# EAGLE design MOSBRIDGE (EAGLE 9.4.2)
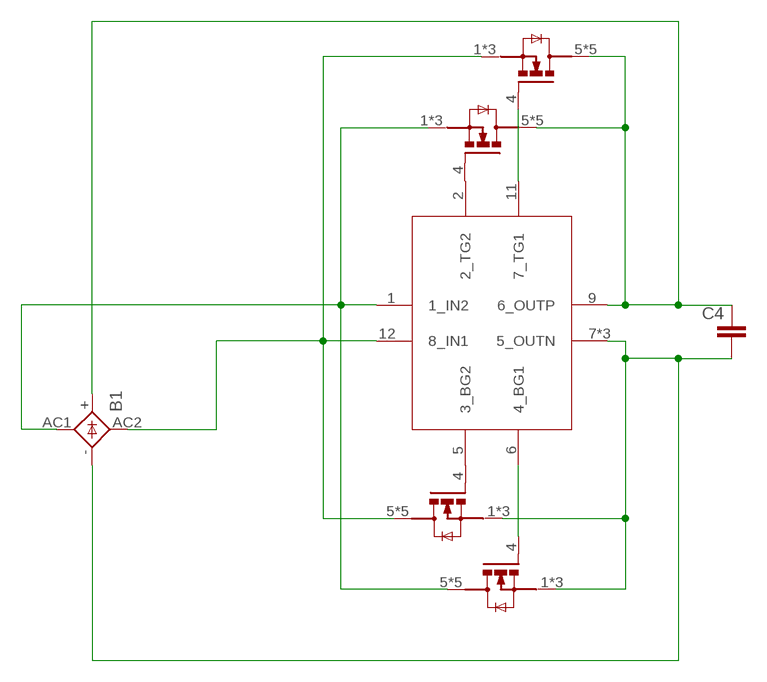
[diagram p0: schematic, sheet 1]

## Parts
B1  GBU4  [GBU4S]
C4  47uF  C-EUC1206  [C1206]
Q1  MOS_SMDTDSON-8  [PG-TDSON-8]
Q2  MOS_SMDTDSON-8  [PG-TDSON-8]
Q3  MOS_SMDTDSON-8  [PG-TDSON-8]
Q4  MOS_SMDTDSON-8  [PG-TDSON-8]
U$1  LT4320MSOP  [LT4320_MSOP]

## Nets
N$2: Q2.4(G) U$1.11(7_TG1)
N$3: B1.+ C4.1 Q1.5(D) Q1.6(D) Q1.7(D) Q1.8(D) Q1.TH(D) Q2.5(D) Q2.6(D) Q2.7(D) Q2.8(D) Q2.TH(D) U$1.9(6_OUTP)
N$4: Q1.4(G) U$1.2(2_TG2)
N$6: Q4.4(G) U$1.6(4_BG1)
N$7: B1.- C4.2 Q3.1(S) Q3.2(S) Q3.3(S) Q4.1(S) Q4.2(S) Q4.3(S) U$1.7(5_OUTN) U$1.EXP1(5_OUTN) U$1.EXP(5_OUTN)
N$8: B1.AC1(AC2) Q1.1(S) Q1.2(S) Q1.3(S) Q4.5(D) Q4.6(D) Q4.7(D) Q4.8(D) Q4.TH(D) U$1.1(1_IN2)
N$9: B1.AC2(AC1) Q2.1(S) Q2.2(S) Q2.3(S) Q3.5(D) Q3.6(D) Q3.7(D) Q3.8(D) Q3.TH(D) U$1.12(8_IN1)
N$10: Q3.4(G) U$1.5(3_BG2)

## Library data of the parts
B1 = Vwvwbg:GBU4: GENERAL INSTRUMENT RECTIFIER
C4 = Vwvwbg:C-EU: CAPACITOR, European symbol
Q1-Q4 = Vwvwbg:MOS_SMD
U$1 = Vwvwbg:LT4320

## Board
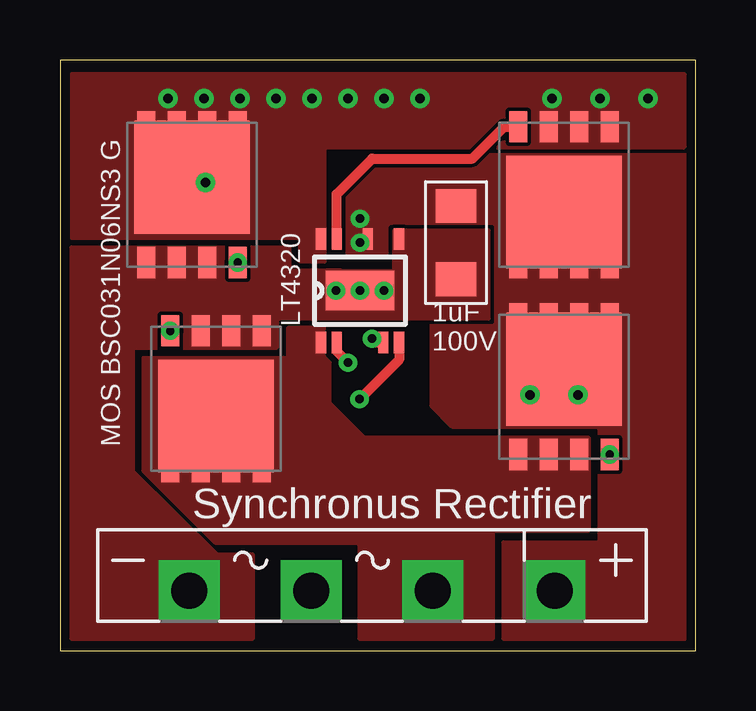
[diagram p1: board, top side]
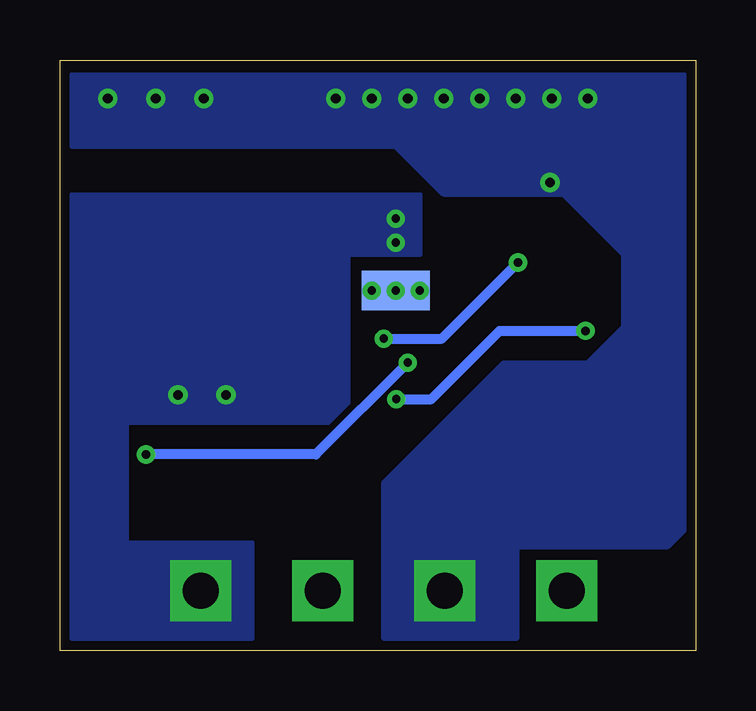
[diagram p2: board, bottom side, seen from below]

Size 26.49 x 24.61 mm. Coordinates in mm from the lower left corner, seen from the top.
Outline: 0,0 26.49,0 26.49,24.61 0,24.61 0,0
Copper layers (1*16): Top 0.035mm / dielectric 0.15mm / Bottom 0.035mm
Design rules "default *": minimum track width 6mil, minimum drill 0.35mm, track to track 6mil, track to pad 6mil, pad to pad 6mil, via to via 6mil, smd to smd 0mil, copper to edge 15mil, drill to drill 6mil, minimum pad ring 10mil, minimum via ring 8mil, stop-mask expansion 4mil, vias tented up to drill 0.5mm, thermal gap 10mil

### Footprints (pad centres in the part's own frame; a part is rotated, then mirrored left to right if it is on the bottom)
GBU4S = drill 1.499 pad 2.54 square: + 7.62,0; - -7.62,0; AC1 2.54,0; AC2 -2.54,0
C1206 = smd 1.4 x 1.7: 1 -1.527,0; 2 1.527,0
PG-TDSON-8 = smd 1.3 x 0.75: 1 -2.825,1.905; 2 -2.825,0.635; 3 -2.825,-0.635; 4 -2.825,-1.905; 5 2.825,-1.905; 6 2.825,-0.635; 7 2.825,0.635; 8 2.825,1.905 | smd 4.7 x 4.8: TH 0.725,0
LT4320_MSOP = smd 0.9 x 0.42: 1 -2.163,1.625; 2 -2.163,0.975; 5 -2.163,-0.975; 6 -2.163,-1.625; 7 2.15,-1.625; 9 2.15,-0.325; 11 2.15,0.975; 12 2.15,1.625 | smd 1.65 x 2.85: EXP 0,0 | smd 1.65 x 2.85 bottom: EXP1 0,0

### Placement (x,y rotation side)
B1  13,2.5 0 top
C4  16.5,17 270 top
Q1  21,11 90 top
Q2  21,19 270 top
Q3  5.5,19 90 top
Q4  6.5,10.5 270 top
U$1  12.5,15 90 top

### Tracks (layer width: path | path; a pad name or v marks a point on that pad's centre or on a via)
N$2
  Top 0.406: U$1.11 11.53,19.02 13,20.5 17.18,20.5 18.5,21.82 Q2.4
N$3  (via drill 0.35, 0.4)
  other vias: 19.58,10.66 21.58,10.66 12.5,18 12.5,17
  pour Top (rank 3, no thermals): 18.5,0.5 18.5,4.5 22.5,4.5 22.5,9.33 16.37,9.33 15.5,10.21 15.5,17.5 12,17.5 12,21 15.5,20.84 26.02,20.84 26.02,0.5
  pour Bottom (isolate 0.254, no thermals): 26,19 11.5,19 11.5,16.5 14.5,16.5 14.5,9.5 23.72,9.5 23.72,4.5 18.5,4.5 18.5,0.5 26,0.5
  pour Top (rank 4, no thermals): 12,16.5 13.6,16.5 13.6,18.5 12,18.5
N$4  (via drill 0.35)
  Top 0.406: U$1.2 11.53,12.47 v12,12
  Bottom 0.406: v12,12 15.82,8.18 Q1.4
  other vias: 22.91,8.18
N$6  (via drill 0.35)
  Top 0.406: U$1.6 14.12,12.12 v12.48,10.48
  Bottom 0.406: v12.48,10.48 11.02,10.48 8.18,13.32 Q4.4
  other vias: 4.59,13.32
N$7  (via drill 0.35)
  other vias: 12.5,15 11.5,15 13.5,15
  pour Top (rank 2, no thermals): 8,4 8,0.5 0.5,0.5 0.5,16.79 9.53,16.81 9.54,16.79 9.54,15.84 13.95,15.81 13.96,15.81 13.96,17.5 17.82,17.5 17.82,13.84 9,13.84 9,12.62 3,12.62 3,7.45 6.5,4
N$8
  pour Top (isolate 0.254, rank 2, no thermals): 3.5,12.18 9.53,12.19 9.53,13.45 11.2,13.45 11.2,10.3 12.63,8.87 22,8.87 22,5 18,5 18,0.5 12.5,0.5 12.5,4.5 6.5,4.5 3.5,7.5
N$9  (via drill 0.4)
  Top 0.61: v6.07,19.5 5.85,19.73 Q3.TH
  other vias: 4.5,23 6,23 7.5,23 9,23 10.5,23 12,23 13.5,23 15,23 20.5,23 22.5,23 24.5,23
  pour Top (no thermals): 0.5,17.22 10,17.22 10,16.24 11.01,16.24 11.01,21 26,21 26,24 0.5,24
  pour Bottom (isolate 0.254, rank 4, no thermals): 7.46,4.31 7.46,0.5 13,0.5 13,7 8,12 4.5,12 3,13.5 3,16.5 5.5,19 10.5,19 12.5,21 26,21 26,24 0.5,24 0.5,5 1.19,4.31
N$10  (via drill 0.35)
  Top 0.406: U$1.5 13.16,12.84 v13,13
  Bottom 0.406: v13,13 10.58,13 Q3.4
  other vias: 7.41,16.18

### Text on the board
tPlace: LT4320 | 1uF / 100V | MOS BSC031N06NS3 G | Synchronus Rectifier